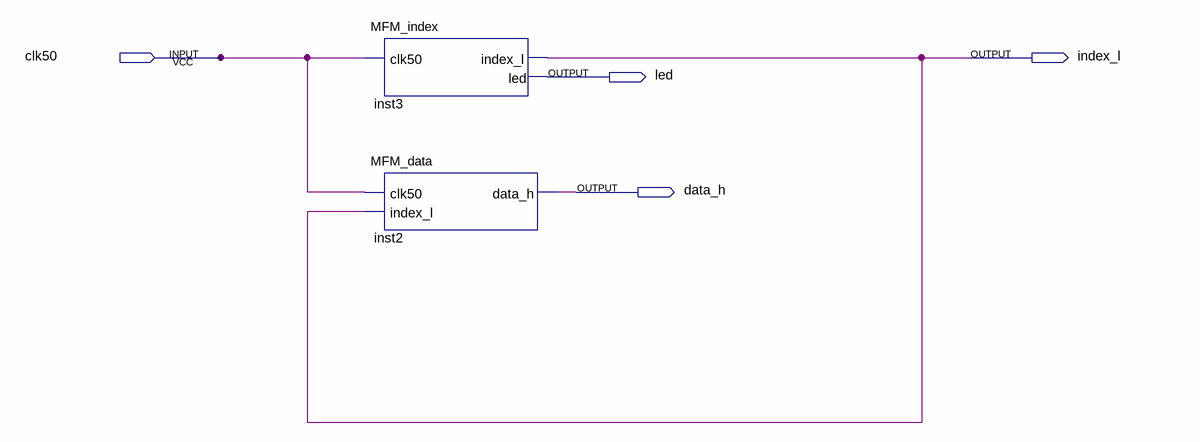
[diagram p0: schematic sheet]
// Quartus schematic mfm_emulator.bdf as structural Verilog: 2 symbols, 4 pins
module mfm_emulator (
  input  clk50,
  output index_l,
  output led,
  output data_h
);

  MFM_index inst3 (.clk50(clk50), .index_l(index_l), .led(led));
  MFM_data inst2 (.clk50(clk50), .index_l(index_l), .data_h(data_h));
endmodule
